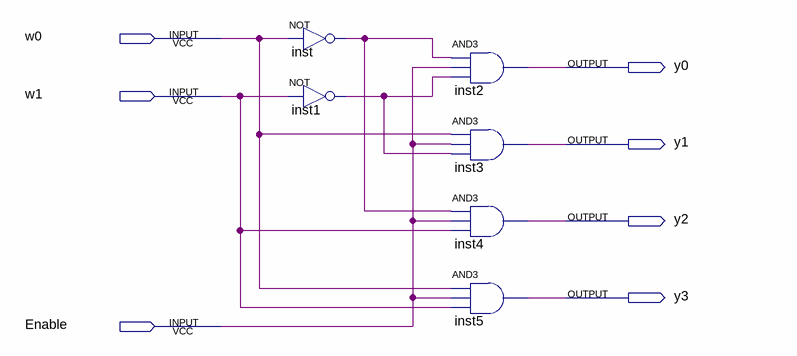
[diagram p0: schematic sheet]
// Quartus schematic decoderEnable2-to-4.bdf as structural Verilog: 6 symbols, 7 pins
module \decoderEnable2-to-4  (
  input  w0,
  input  w1,
  input  Enable,
  output y0,
  output y1,
  output y2,
  output y3
);

  wire inst1_out, inst_out;

  not inst (inst_out, w0);
  not inst1 (inst1_out, w1);
  and inst2 (y0, inst_out, Enable, inst1_out);
  and inst3 (y1, w0, Enable, inst1_out);
  and inst4 (y2, inst_out, Enable, w1);
  and inst5 (y3, w0, Enable, w1);
endmodule
